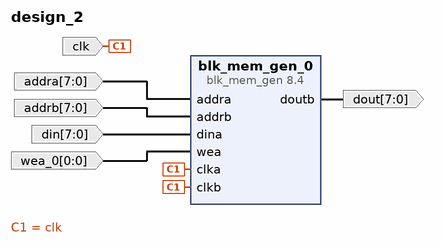
[diagram p0: block diagram of the top level]
# Vivado block design design_2, xc7a100tcsg324-1, Vivado 2023.2
create_bd_design design_2

create_bd_port -dir I -from 7 -to 0 addra
create_bd_port -dir I -type clk clk
create_bd_port -dir I -from 7 -to 0 din
create_bd_port -dir I -from 0 -to 0 wea_0
create_bd_port -dir I -from 7 -to 0 addrb
create_bd_port -dir O -from 7 -to 0 dout

create_bd_cell -type ip -vlnv xilinx.com:ip:blk_mem_gen:8.4 blk_mem_gen_0
set_property -dict [list \
  CONFIG.Assume_Synchronous_Clk true \
  CONFIG.Enable_A Always_Enabled \
  CONFIG.Enable_B Always_Enabled \
  CONFIG.Memory_Type Simple_Dual_Port_RAM \
  CONFIG.Operating_Mode_A WRITE_FIRST \
  CONFIG.Register_PortB_Output_of_Memory_Primitives false \
  CONFIG.Write_Depth_A 256 \
  CONFIG.Write_Width_A 8 \
  CONFIG.use_bram_block Stand_Alone \
] [get_bd_cells blk_mem_gen_0]

# ---- connections ----

connect_bd_net [get_bd_ports addra] [get_bd_pins blk_mem_gen_0/addra]
connect_bd_net [get_bd_ports addrb] [get_bd_pins blk_mem_gen_0/addrb]
connect_bd_net [get_bd_pins blk_mem_gen_0/doutb] [get_bd_ports dout]
connect_bd_net -net clka_0_1 [get_bd_ports clk] [get_bd_pins blk_mem_gen_0/clka] [get_bd_pins blk_mem_gen_0/clkb]
connect_bd_net [get_bd_ports din] [get_bd_pins blk_mem_gen_0/dina]
connect_bd_net -net wea_0_1 [get_bd_ports wea_0] [get_bd_pins blk_mem_gen_0/wea]

validate_bd_design
save_bd_design
